# EasyEDA Pro project ProPrj_AI台灯_模块版_2026-09-22.epro, schematic Schematic1, sheet 5 of 5

## Sheets
5 INTERFACE: Page Name: P6
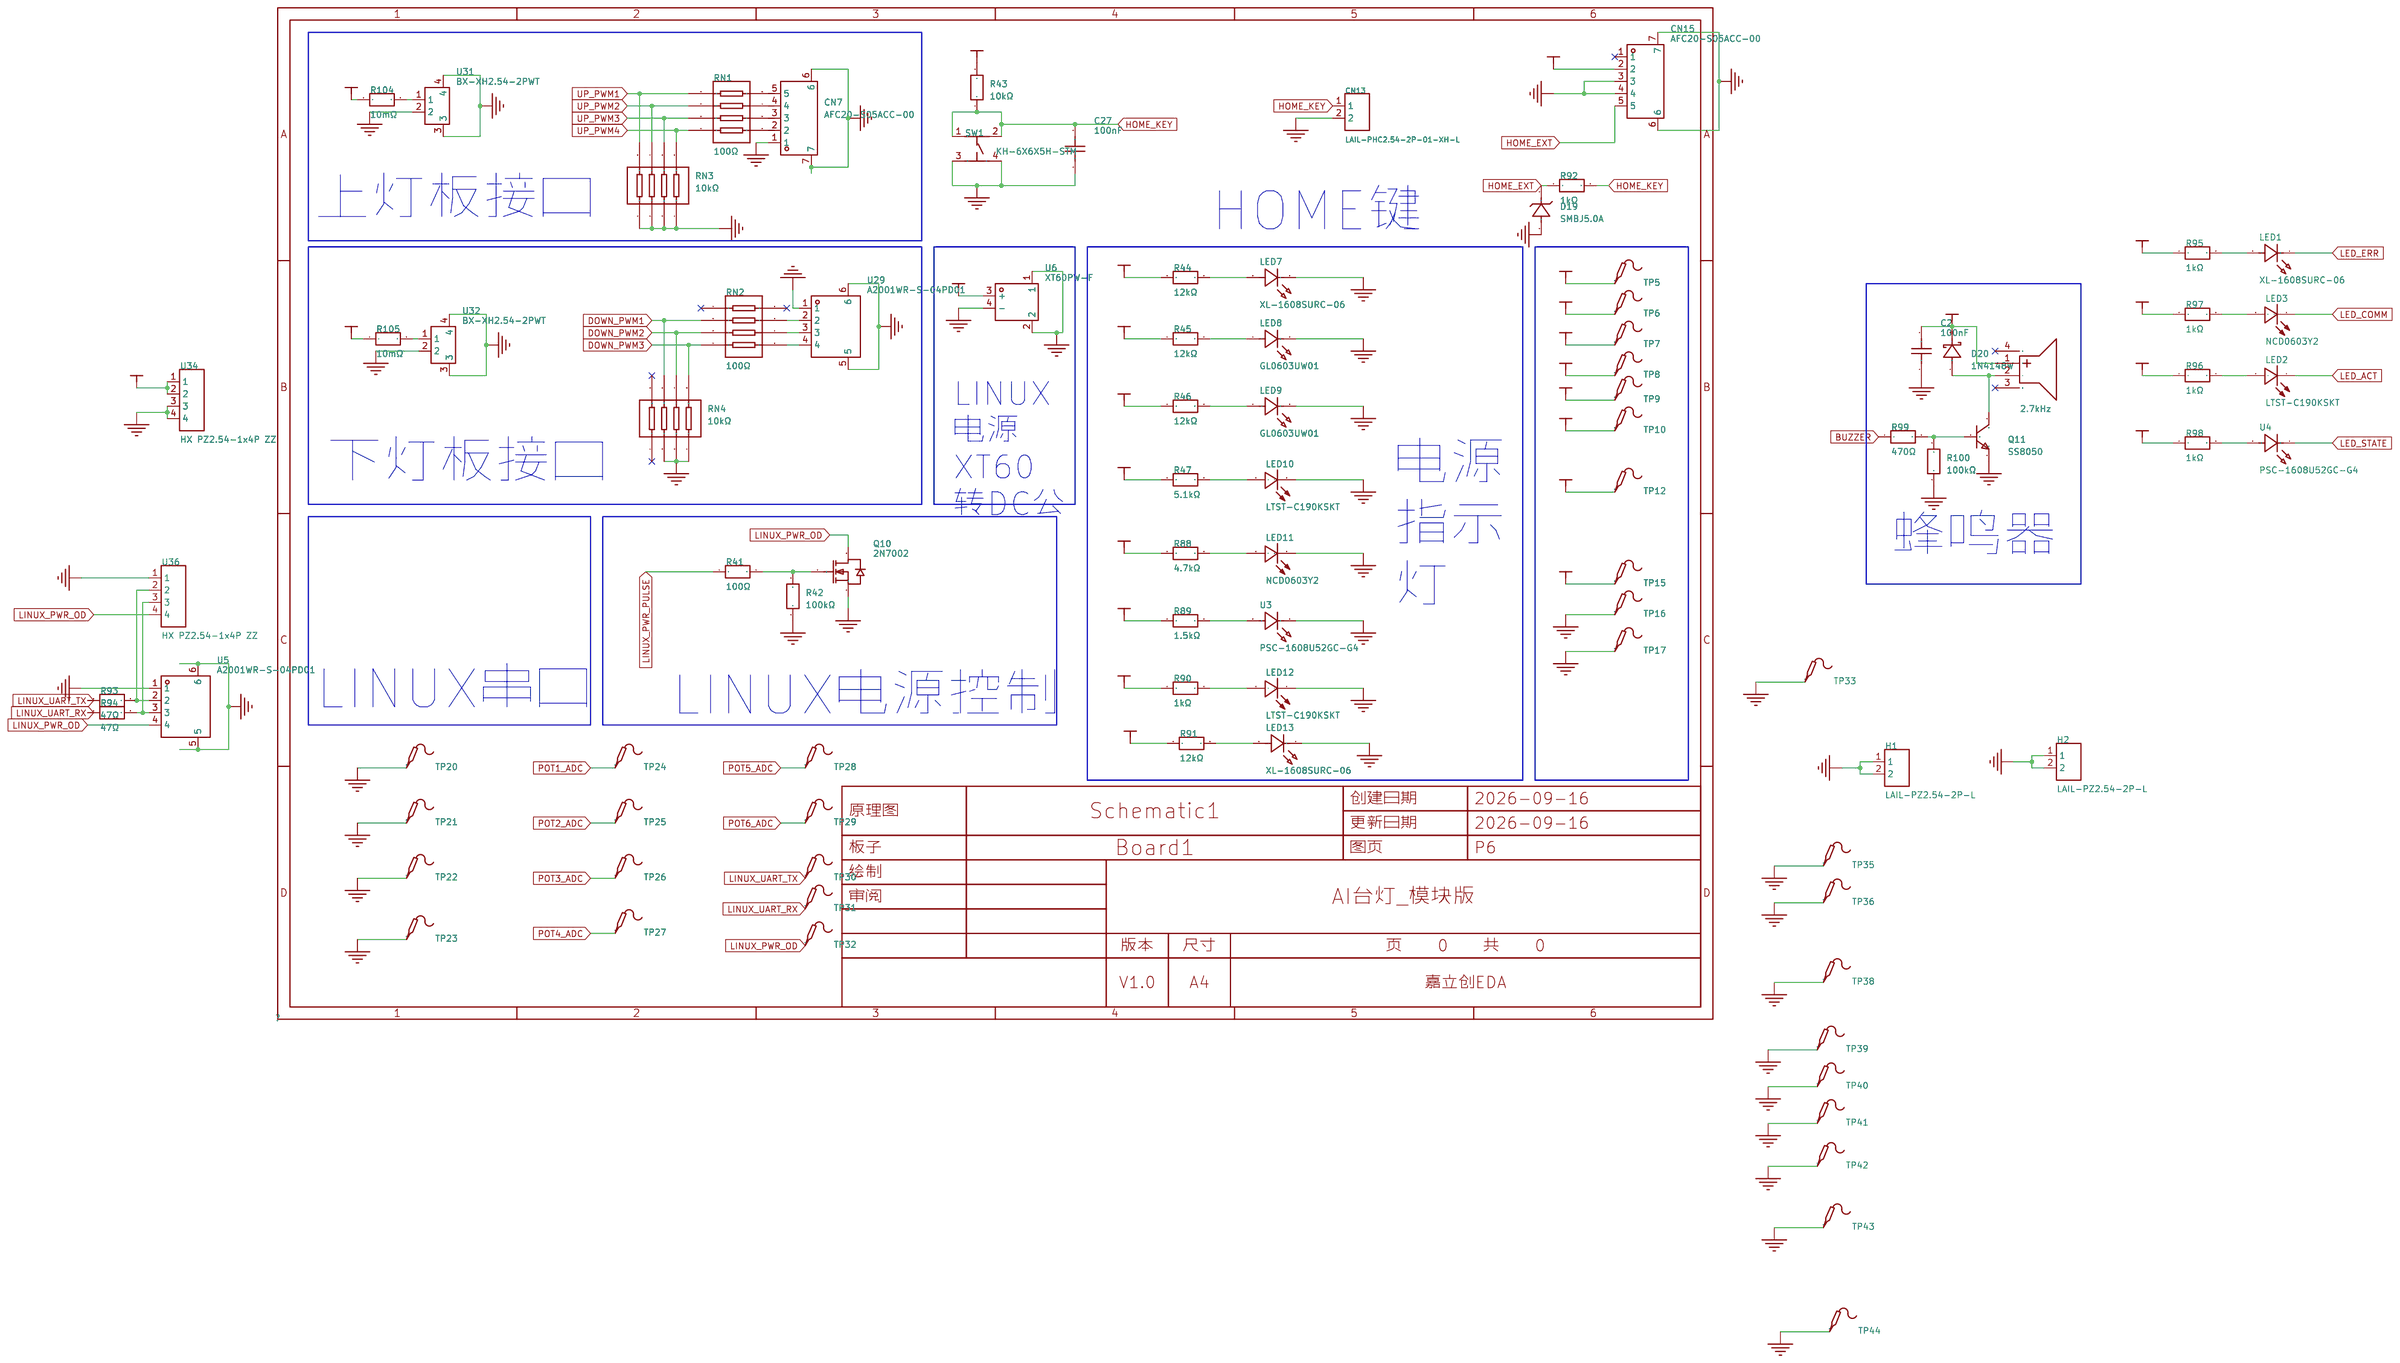
[diagram p4: INTERFACE]

## Parts
BUZZER1  2.7kHz  [BUZ-SMD_4P-L7.5-W7.5-P7.59-TL]
C2  100nF  [C0603]
C27  100nF  [C0603]
CN7  AFC20-S05ACC-00  [CONN-SMD_AFC20-S05ACC-00]
CN13  LAIL-PHC2.54-2P-01-XH-L  [CONN-TH_2P-P2.50_HC-XH-2A-G]
CN15  AFC20-S05ACC-00  [CONN-SMD_AFC20-S05ACC-00]
D19  SMBJ5.0A  [SMB_L4.6-W3.6-LS5.4-RD]
D20  1N4148W  [SOD-123_L2.7-W1.6-LS3.7-FD]
H1  LAIL-PZ2.54-2P-L  [CONN-TH_LAIL-PZ2.54-2P-L]
H2  LAIL-PZ2.54-2P-L  [CONN-TH_LAIL-PZ2.54-2P-L]
LED1  XL-1608SURC-06  [LED0603-RD_RED]
LED2  LTST-C190KSKT  [LED0603-RD]
LED3  NCD0603Y2  [LED0603-RD]
LED7  XL-1608SURC-06  [LED0603-RD_RED]
LED8  GL0603UW01  [LED0603-R-RD]
LED9  GL0603UW01  [LED0603-R-RD]
LED10  LTST-C190KSKT  [LED0603-RD]
LED11  NCD0603Y2  [LED0603-RD]
LED12  LTST-C190KSKT  [LED0603-RD]
LED13  XL-1608SURC-06  [LED0603-RD_RED]
Q10  2N7002  [SOT-23-3_L2.9-W1.3-P1.90-LS2.4-BR]
Q11  SS8050  [SOT-23-3_L2.9-W1.3-P1.90-LS2.4-BR]
R41  100Ω  [R0603]
R42  100kΩ  [R0603]
R43  10kΩ  [R0603]
R44  12kΩ  [R0603]
R45  12kΩ  [R0603]
R46  12kΩ  [R0603]
R47  5.1kΩ  [R0603]
R88  4.7kΩ  [R0603]
R89  1.5kΩ  [R0603]
R90  1kΩ  [R0603]
R91  12kΩ  [R0603]
R92  1kΩ  [R0603]
R93  47Ω  [R0603]
R94  47Ω  [R0603]
R95  1kΩ  [R0603]
R96  1kΩ  [R0603]
R97  1kΩ  [R0603]
R98  1kΩ  [R0603]
R99  470Ω  [R0603]
R100  100kΩ  [R0603]
R104  10mΩ  [R2512]
R105  10mΩ  [R2512]
RN1  100Ω  [RES-ARRAY-SMD_0603-8P-L3.2-W1.6-BL]
RN2  100Ω  [RES-ARRAY-SMD_0603-8P-L3.2-W1.6-BL]
RN3  10kΩ  [RES-ARRAY-SMD_0603-8P-L3.2-W1.6-BL]
RN4  10kΩ  [RES-ARRAY-SMD_0603-8P-L3.2-W1.6-BL]
SW1  KH-6X6X5H-STM  [SW-SMD_4P-L6.0-W6.0-P4.50-LS9.0_H5.0]
TP5  -  [Test-Point-0.5mm]
TP6  -  [Test-Point-0.5mm]
TP7  -  [Test-Point-0.5mm]
TP8  -  [Test-Point-0.5mm]
TP9  -  [Test-Point-0.5mm]
TP10  -  [Test-Point-0.5mm]
TP12  -  [Test-Point-0.5mm]
TP15  -  [Test-Point-0.5mm]
TP16  -  [Test-Point-0.5mm]
TP17  -  [Test-Point-0.5mm]
TP20  -  [Test-Point-0.5mm]
TP21  -  [Test-Point-0.5mm]
TP22  -  [Test-Point-0.5mm]
TP23  -  [Test-Point-0.5mm]
TP24  -  [Test-Point-0.5mm]
TP25  -  [Test-Point-0.5mm]
TP26  -  [Test-Point-0.5mm]
TP27  -  [Test-Point-0.5mm]
TP28  -  [Test-Point-0.5mm]
TP29  -  [Test-Point-0.5mm]
TP30  -  [Test-Point-0.5mm]
TP31  -  [Test-Point-0.5mm]
TP32  -  [Test-Point-0.5mm]
TP33  -  [Test-Point-0.5mm]
TP35  -  [Test-Point-0.5mm]
TP36  -  [Test-Point-0.5mm]
TP38  -  [Test-Point-0.5mm]
TP39  -  [Test-Point-0.5mm]
TP40  -  [Test-Point-0.5mm]
TP41  -  [Test-Point-0.5mm]
TP42  -  [Test-Point-0.5mm]
TP43  -  [Test-Point-0.5mm]
TP44  -  [Test-Point-0.5mm]
U3  PSC-1608U52GC-G4  [LED0603-RD_GREEN]
U4  PSC-1608U52GC-G4  [LED0603-RD_GREEN]
U5  A2001WR-S-04PD01  [CONN-SMD_A2001WR-S-04PD01]
U6  XT60PW-F  [TH_2P-XT60PW-F]
U29  A2001WR-S-04PD01  [CONN-SMD_A2001WR-S-04PD01]
U31  BX-XH2.54-2PWT  [CONN-SMD_2P-P2.50_BX-XH2.54-2PWT]
U32  BX-XH2.54-2PWT  [CONN-SMD_2P-P2.50_BX-XH2.54-2PWT]
U34  HX PZ2.54-1x4P ZZ  [HDR-TH_4P-P2.54-V-M]
U36  HX PZ2.54-1x4P ZZ  [HDR-TH_4P-P2.54-V-M]

## Library data of the parts
BUZZER1 = MLT-7525: 驱动方式:无源(外部驱动);构造类型:电磁式;频率:2.7kHz;声压(SPL):80dB;; Supplier Part: C95299; Manufacturer: 华能; Supplier Footprint: SMD,7.5x7.5mm; JLCPCB Part Class: 扩展库; Datasheet: https://atta.szlcsc.com/upload/public/pdf/source/20220727/FE97E50F9310EA274907AB736C1C5504.pdf; Supplier: LCSC; Driver Circuitry: 无源(外部驱动); Technology: 电磁式; Voltage - Supply: 2.5V~4.5V; Sound Pressure Level(SPL): 80dB; Length: 7.5mm; Width: 7.5mm; Height: 2.8mm
C2 C27 = CC0603KRX7R0BB104: 容值:100nF;精度:±10%;额定电压:100V;温度系数:X7R;; LCSC Part Name: 100nF ±10% 100V; Supplier Part: C113803; Manufacturer: YAGEO(国巨); Supplier Footprint: 0603; JLCPCB Part Class: Extended Part; Datasheet: https://item.szlcsc.com/datasheet/CC0603KRX7R0BB104/115039.html; Supplier: LCSC; Tolerance: ±10%; Voltage Rating: 100V; Temperature Coefficient: X7R
CN7 CN15 = AFC20-S05ACC-00: 插针结构:1x5P;间距:2mm;安装方式:卧贴;参考系列:PH;总PIN数:5P;排数:1;每排PIN数:5;行距:-;额定电流:1A;触头材质:黄铜;触头镀层:锡;工作温度:-20℃~+85℃;; LCSC Part Name: 1x5P 间距:2mm 卧贴 系列:PH; Supplier Part: C395361; Manufacturer: JS(钜硕电子); Supplier Footprint: SMD,P=2mm; JLCPCB Part Class: Extended Part; Datasheet: https://item.szlcsc.com/datasheet/AFC20-S05ACC-00/375897.html; Supplier: LCSC; Pins Structure: 1x5P; Pitch: 2mm; Mounting Type: 卧贴; Reference Series: PH; Number of Pins: 5P; Number of Rows: 1; Number of PINs Per Row: 5; Current Rating: 1A; Contact Material: 黄铜; Contact Plating: 锡; Operating Temperature: -20℃~+85℃; Voltage Rating: 100V; Plastic Material: LCP; Flame Retardant Rating: UL94V-0; Color: 米色; Z-Height of the Board: 5.55mm; X-Length of Bottom Edge on Board (Spacing Line): 14mm
CN13 = LAIL-PHC2.54-2P-01-XH-L: 插针结构:1x2P;间距:2.54mm;安装方式:直插;参考系列:XH;总PIN数:2P;排数:1;每排PIN数:2;额定电流:3A;触头材质:黄铜;触头镀层:锡;工作温度:-25℃~+85℃;; LCSC Part Name: 1x2P 间距:2.54mm 直插 系列:XH; Supplier Part: C54905973; Manufacturer: LAILAN(莱联); Supplier Footprint: 插件,P=2.5mm; JLCPCB Part Class: Extended Part; Datasheet: https://item.szlcsc.com/datasheet/LAIL-PHC2.54-2P-01-XH-L/58431100.html; Supplier: LCSC; Pins Structure: 1x2P; Pitch: 2.54mm; Mounting Type: 直插; Reference Series: XH; Number of Pins: 2P; Number of Rows: 1; Number of PINs Per Row: 2; Current Rating: 3A; Contact Material: 黄铜; Contact Plating: 锡; Operating Temperature: -25℃~+85℃; Voltage Rating: 250V; Plastic Material: PA66; Flame Retardant Rating: UL94V-0; Color: 白色; Z-Height of the Board: 7.1mm; X-Length of Bottom Edge on Board (Spacing Line): 7.5mm; Y-Width of Bottom Edge on Board: 5.8mm
D19 = SMBJ5.0A_C19077558: 极性:单向;反向截止电压(Vrwm):5V;钳位电压:9.2V;峰值脉冲电流(Ipp):65.22A@10/1000us;峰值脉冲功率(Ppp):600W@10/1000us;击穿电压(VBR):7V;; LCSC Part Name: 单向TVS 5V截止 峰值浪涌电流：65.22A@10/1000us; Supplier Part: C19077558; Manufacturer: R+O(宏嘉诚); Supplier Footprint: DO-214AA(SMB); JLCPCB Part Class: Extended Part; Datasheet: https://item.szlcsc.com/datasheet/SMBJ5.0A/20275643.html; Supplier: LCSC; Polarity: 单向; Reverse Stand-Off Voltage (Vrwm): 5V; Clamping Voltage: 9.2V; Peak Pulse Current (Ipp): 65.22A@10/1000us; Peak Pulse Power Dissipation (Ppp): 600W@10/1000us; Voltage - Breakdown: 7V; Reverse Leakage Current (Ir): 800uA; Number of Channels: 单路; Operating Temperature: -55℃~+150℃; level of protection: IEC 61000-4-2; Type: TVS
D20 = 1N4148W_C7420318: 二极管配置:独立式;整流电流:150mA;直流反向耐压(Vr):100V;正向压降(Vf):1.25V@150mA;反向恢复时间(Trr):4ns;; LCSC Part Name: 100V 150mA; Supplier Part: C7420318; Manufacturer: R+O(宏嘉诚); Supplier Footprint: SOD-123; JLCPCB Part Class: Extended Part; Datasheet: https://item.szlcsc.com/datasheet/1N4148W/8397140.html; Supplier: LCSC; Diode Configuration: 独立式; Voltage - Forward(Vf@If): 1.25V@150mA; Voltage - DC Reverse(Vr): 100V; Current - Rectified: 150mA; Reverse Leakage Current (Ir): 1uA@75V; Reverse Recovery Time (trr): 4ns; Operating Junction Temperature Range: -55℃~+150℃; Pd - Power Dissipation: 400mW; Non-Repetitive Peak Forward Surge Current: 2A
H1 H2 = LAIL-PZ2.54-2P-L: 插针结构:1x2P;间距:2.54mm;圆针/方针:方针;排数:单排;总PIN位数:2P;额定电流:3A;额定电压:250V;塑高:2.5mm;端接针长度:3mm;触头材质:黄铜;触头镀层:金;工作温度:-25℃~+80℃;颜色:黑色;; LCSC Part Name: 1x2P 间距:2.54mm 方针; Supplier Part: C54950603; Manufacturer: 莱联; Supplier Footprint: 插件,P=2.54mm; JLCPCB Part Class: Extended Part; Datasheet: https://item.szlcsc.com/datasheet/LAIL-PZ2.54-2P-L/58519956.html; Supplier: LCSC; Pin Structure: 1x2P; Pitch: 2.54mm; Circluar Pins/Square Pins: 方针; Number of Rows: 单排; Number of Pins: 2P; Current Rating: 3A; Voltage Rating (Max): 250V; Insulation Height: 2.5mm; Length of End Connection Pin: 3mm; Contact Material: 黄铜; Contact Plating: 金; Operating Temperature: -25℃~+80℃; Color: 黑色
LED1 LED7 LED13 = XL-1608SURC-06: 灯头类型:1.6mmx0.8mm方形灯头;发光颜色:红色;正向压降(Vf):2.3V;功率:50mW;正向电流:20mA;波长:620nm~630nm;二极管配置:独立二极管;透镜颜色:无色透明透镜;色温:-;发光强度:225mcd;发光角度:120°;载带方式:正贴;工作温度:-40℃~+85℃;; LCSC Part Name: 0603红色贴片式发光二极管; Supplier Part: C965799; Manufacturer: XINGLIGHT(成兴光); Supplier Footprint: 0603; JLCPCB Part Class: Extended Part; Datasheet: https://item.szlcsc.com/datasheet/XL-1608SURC-06/1051408.html; Supplier: LCSC; Lamp Holder Type: 1.6mmx0.8mm方形灯头; Illumination Color: 红色; Voltage - Forward(Vf): 2.3V; Power(Watts): 50mW; Forward Current: 20mA; Wavelength - Dominant: 620nm~630nm; Peak Wavelength: 625nm; Diode Configuration: 独立二极管; Lens Color: 无色透明透镜; Luminous Intensity: 225mcd; Viewing Angle: 120°; Mounting Style: 正贴; Operating Temperature: -40℃~+85℃
LED2 LED10 LED12 = LTST-C190KSKT: 灯头类型:-;发光颜色:黄色;正向压降(Vf):2.1V;功率:75mW;正向电流:20mA;波长:584.5nm~597nm;二极管配置:独立二极管;透镜颜色:无色透明透镜;色温:-;发光强度:104mcd;发光角度:130°;载带方式:-;工作温度:-30℃~+85℃;; LCSC Part Name: 黄灯; Supplier Part: C125095; Manufacturer: LITEON(光宝); Supplier Footprint: 0603; JLCPCB Part Class: Extended Part; Datasheet: https://item.szlcsc.com/datasheet/LTST-C190KSKT/136371.html; Supplier: LCSC; Illumination Color: 黄色; Voltage - Forward(Vf): 2.1V; Power(Watts): 75mW; Forward Current: 20mA; Wavelength - Dominant: 584.5nm~597nm; Peak Wavelength: 588nm; Diode Configuration: 独立二极管; Lens Color: 无色透明透镜; Luminous Intensity: 104mcd; Viewing Angle: 130°; Operating Temperature: -30℃~+85℃
LED3 LED11 = NCD0603Y2: 灯头类型:1.6mmx0.8mm方形灯头;发光颜色:黄色;正向压降(Vf):1.6V~2.6V;功率:65mW;测试电流:25mA;波长:586nm~595nm;二极管配置:独立二极管;透镜颜色:-;色温:-;发光强度:220mcd;发光角度:130°;载带方式:-;工作温度:-30℃~+85℃;; LCSC Part Name: 片式发光二极管; Supplier Part: C89811; Manufacturer: 国星光电; Supplier Footprint: 0603; JLCPCB Part Class: Extended Part; Datasheet: https://item.szlcsc.com/datasheet/NCD0603Y2/90993.html; Supplier: LCSC; Lamp Holder Type: 1.6mmx0.8mm方形灯头; Illumination Color: 黄色; Voltage - Forward(Vf): 1.6V~2.6V; Power(Watts): 65mW; Test Current: 25mA; Wavelength - Dominant: 586nm~595nm; Peak Wavelength: 595nm; Diode Configuration: 独立二极管; Luminous Intensity: 220mcd; Viewing Angle: 130°; Operating Temperature: -30℃~+85℃; Half wave width: 15nm
LED8 LED9 = GL0603UW01: 灯头类型:1.6mmx0.8mm方形灯头;发光颜色:白色;正向压降(Vf):2.5V~3.2V;功率:-;测试电流:5mA;波长:-;二极管配置:独立二极管;透镜颜色:雾状黄色透镜;色温:25000K;发光强度:50mcd~124mcd;发光角度:120°;载带方式:正贴;工作温度:-40℃~+85℃;; LCSC Part Name: 0603 白灯 高亮; Supplier Part: C51933297; Manufacturer: Guiguang light(桂光光电); Supplier Footprint: 0603; JLCPCB Part Class: Extended Part; Datasheet: https://item.szlcsc.com/datasheet/GL0603UW01/54645993.html; Supplier: LCSC; Lamp Holder Type: 1.6mmx0.8mm方形灯头; Illumination Color: 白色; Voltage - Forward(Vf): 2.5V~3.2V; Test Current: 5mA; Diode Configuration: 独立二极管; Lens Color: 雾状黄色透镜; Color Temperature: 25000K; Luminous Intensity: 50mcd~124mcd; Viewing Angle: 120°; Mounting Style: 正贴; Operating Temperature: -40℃~+85℃
Q10 = 2N7002_C7420321: 数量:1个N沟道;漏源电压(Vdss):60V;连续漏极电流(Id):115mA;导通电阻(RDS(on)):900mΩ@10V;耗散功率(Pd):225mW;阈值电压(Vgs(th)):1.6V;; LCSC Part Name: N沟道,电流:115mA,耐压:60V; Supplier Part: C7420321; Manufacturer: R+O(宏嘉诚); Supplier Footprint: SOT-23; JLCPCB Part Class: Extended Part; Datasheet: https://item.szlcsc.com/datasheet/2N7002/8397143.html; Supplier: LCSC; Number: 1个N沟道; Drain to Source Voltage: 60V; Current - Continuous Drain(Id): 115mA; RDS(on): 900mΩ@10V; Pd - Power Dissipation: 225mW; Gate Threshold Voltage (Vgs(th)): 1.6V; Gate Charge(Qg): 1.6nC@10V; Input Capacitance(Ciss): 50pF; Reverse Transfer Capacitance (Crss@Vds): 5pF; Operating Temperature: -55℃~+150℃; Type: N沟道; Output Capacitance(Coss): 25pF
Q11 = SS8050_C7420370: 晶体管类型:NPN;集电极电流(Ic):1.5A;集射极击穿电压(Vceo):25V;耗散功率(Pd):300mW;直流电流增益(hFE):120;; LCSC Part Name: H档 200-350 NPN 电流:1.5A 电压:25V; Supplier Part: C7420370; Manufacturer: R+O(宏嘉诚); Supplier Footprint: SOT-23; JLCPCB Part Class: Extended Part; Datasheet: https://item.szlcsc.com/datasheet/SS8050/8397192.html; Supplier: LCSC; type: NPN; Current - Collector(Ic): 1.5A; Collector - Emitter Voltage VCEO: 25V; Pd - Power Dissipation: 300mW; DC Current Gain: 120; Transition frequency(fT): 100MHz; Current - Collector Cutoff: 100nA; Vce Saturation(VCE(sat)): 500mV; Operating Temperature: -55℃~+150℃; Emitter-Base Voltage(Vebo): 5V; Number: 1个NPN; Configuration: 独立式
R41 = FRC0603F1000TS: 电阻类型:厚膜电阻;阻值:100Ω;精度:±1%;功率:100mW;工作电压:75V;温度系数:±100ppm/℃;; LCSC Part Name: 100Ω ±1% 100mW 厚膜电阻; Supplier Part: C2906981; Manufacturer: FOJAN(富捷); Supplier Footprint: 0603; JLCPCB Part Class: Extended Part; Datasheet: https://item.szlcsc.com/datasheet/FRC0603F1000TS/3180494.html; Supplier: LCSC; Type: 厚膜电阻; Tolerance: ±1%; Power(Watts): 100mW; Voltage-Supply(Max): 75V; Temperature Coefficient: ±100ppm/℃; Operating Temperature: -55℃~+155℃
R42 R100 = FRC0603F1003TS: 电阻类型:厚膜电阻;阻值:100kΩ;精度:±1%;功率:100mW;工作电压:75V;温度系数:±100ppm/℃;; LCSC Part Name: 100kΩ ±1% 100mW 厚膜电阻; Supplier Part: C2906980; Manufacturer: FOJAN(富捷); Supplier Footprint: 0603; JLCPCB Part Class: Extended Part; Datasheet: https://item.szlcsc.com/datasheet/FRC0603F1003TS/3180493.html; Supplier: LCSC; Type: 厚膜电阻; Tolerance: ±1%; Power(Watts): 100mW; Voltage-Supply(Max): 75V; Temperature Coefficient: ±100ppm/℃; Operating Temperature: -55℃~+155℃
R43 = FRC0603J103 TS: 电阻类型:厚膜电阻;阻值:10kΩ;精度:±5%;功率:100mW;工作电压:75V;温度系数:±100ppm/℃;; LCSC Part Name: 10kΩ ±5% 100mW 厚膜电阻; Supplier Part: C2930027; Manufacturer: FOJAN(富捷); Supplier Footprint: 0603; JLCPCB Part Class: Extended Part; Datasheet: https://item.szlcsc.com/datasheet/FRC0603J103%2520TS/3266960.html; Supplier: LCSC; Type: 厚膜电阻; Tolerance: ±5%; Power(Watts): 100mW; Voltage-Supply(Max): 75V; Temperature Coefficient: ±100ppm/℃; Operating Temperature: -55℃~+155℃
R44-R46 R91 = FRC0603F1202TS: 电阻类型:厚膜电阻;阻值:12kΩ;精度:±1%;功率:100mW;工作电压:75V;温度系数:±100ppm/℃;; LCSC Part Name: 12kΩ ±1% 100mW 厚膜电阻; Supplier Part: C2906989; Manufacturer: FOJAN(富捷); Supplier Footprint: 0603; JLCPCB Part Class: Extended Part; Datasheet: https://item.szlcsc.com/datasheet/FRC0603F1202TS/3180502.html; Supplier: LCSC; Type: 厚膜电阻; Tolerance: ±1%; Power(Watts): 100mW; Voltage-Supply(Max): 75V; Temperature Coefficient: ±100ppm/℃; Operating Temperature: -55℃~+155℃
R47 = FRC0603F5101TS: 电阻类型:厚膜电阻;阻值:5.1kΩ;精度:±1%;功率:100mW;工作电压:75V;温度系数:±100ppm/℃;; LCSC Part Name: 5.1kΩ ±1% 100mW 厚膜电阻; Supplier Part: C2907044; Manufacturer: FOJAN(富捷); Supplier Footprint: 0603; JLCPCB Part Class: Extended Part; Supplier: LCSC; Type: 厚膜电阻; Tolerance: ±1%; Power(Watts): 100mW; Voltage-Supply(Max): 75V; Temperature Coefficient: ±100ppm/℃; Operating Temperature: -55℃~+155℃
R88 = FRC0603F4701TS: 电阻类型:厚膜电阻;阻值:4.7kΩ;精度:±1%;功率:100mW;工作电压:75V;温度系数:±100ppm/℃;; LCSC Part Name: 4.7kΩ ±1% 100mW 厚膜电阻; Supplier Part: C2907034; Manufacturer: FOJAN(富捷); Supplier Footprint: 0603; JLCPCB Part Class: Extended Part; Datasheet: https://item.szlcsc.com/datasheet/FRC0603F4701TS/3180547.html; Supplier: LCSC; Type: 厚膜电阻; Tolerance: ±1%; Power(Watts): 100mW; Voltage-Supply(Max): 75V; Temperature Coefficient: ±100ppm/℃; Operating Temperature: -55℃~+155℃
R89 = FRC0603F1501TS: 电阻类型:厚膜电阻;阻值:1.5kΩ;精度:±1%;功率:100mW;工作电压:75V;温度系数:±100ppm/℃;; LCSC Part Name: 1.5kΩ ±1% 100mW 厚膜电阻; Supplier Part: C2930050; Manufacturer: FOJAN(富捷); Supplier Footprint: 0603; JLCPCB Part Class: Extended Part; Supplier: LCSC; Type: 厚膜电阻; Tolerance: ±1%; Power(Watts): 100mW; Voltage-Supply(Max): 75V; Temperature Coefficient: ±100ppm/℃; Operating Temperature: -55℃~+155℃
R90 R92 R95-R98 = FRC0603F1001TS: 电阻类型:厚膜电阻;阻值:1kΩ;精度:±1%;功率:100mW;工作电压:75V;温度系数:±100ppm/℃;; LCSC Part Name: 1kΩ ±1% 100mW 厚膜电阻; Supplier Part: C2907002; Manufacturer: FOJAN(富捷); Supplier Footprint: 0603; JLCPCB Part Class: Extended Part; Datasheet: https://item.szlcsc.com/datasheet/FRC0603F1001TS/3180515.html; Supplier: LCSC; Type: 厚膜电阻; Tolerance: ±1%; Power(Watts): 100mW; Voltage-Supply(Max): 75V; Temperature Coefficient: ±100ppm/℃; Operating Temperature: -55℃~+155℃
R93 R94 = FRC0603F47R0TS: 电阻类型:厚膜电阻;阻值:47Ω;精度:±1%;功率:100mW;工作电压:75V;温度系数:±100ppm/℃;; LCSC Part Name: 47Ω ±1% 100mW 厚膜电阻; Supplier Part: C2907043; Manufacturer: FOJAN(富捷); Supplier Footprint: 0603; JLCPCB Part Class: Extended Part; Datasheet: https://item.szlcsc.com/datasheet/FRC0603F47R0TS/3180556.html; Supplier: LCSC; Type: 厚膜电阻; Tolerance: ±1%; Power(Watts): 100mW; Voltage-Supply(Max): 75V; Temperature Coefficient: ±100ppm/℃; Operating Temperature: -55℃~+155℃
R99 = FRC0603J471 TS: 电阻类型:厚膜电阻;阻值:470Ω;精度:±5%;功率:100mW;工作电压:75V;温度系数:±100ppm/℃;; LCSC Part Name: 470Ω ±5% 100mW 厚膜电阻; Supplier Part: C2907172; Manufacturer: FOJAN(富捷); Supplier Footprint: 0603; JLCPCB Part Class: Extended Part; Supplier: LCSC; Type: 厚膜电阻; Tolerance: ±5%; Power(Watts): 100mW; Voltage-Supply(Max): 75V; Temperature Coefficient: ±100ppm/℃; Operating Temperature: -55℃~+155℃
R104 R105 = JER2512F2R010: 电阻类型:采样电阻;阻值:10mΩ;精度:±1%;功率:2W;温度系数:±50ppm/℃;; LCSC Part Name: 10mΩ 2W 2512 ±1%; Supplier Part: C49164691; Manufacturer: JIERR(捷而瑞); Supplier Footprint: 2512; JLCPCB Part Class: Extended Part; Datasheet: https://item.szlcsc.com/datasheet/JER2512F2R010/51553034.html; Supplier: LCSC; Type: 采样电阻; Tolerance: ±1%; Power(Watts): 2W; Temperature Coefficient: ±50ppm/℃
RN1 RN2 = 4D03WGJ0101T5E: 电阻器数:4;阻值:100Ω;精度:±5%;单个元件功率:62.5mW;温度系数:±200ppm/℃;; LCSC Part Name: 100Ω ±5%; Supplier Part: C25506; Manufacturer: UNI-ROYAL(厚声); Supplier Footprint: 0603x4; JLCPCB Part Class: Extended Part; Datasheet: https://item.szlcsc.com/datasheet/4D03WGJ0101T5E/26249.html; Supplier: LCSC; Number of Resistors: 4; Tolerance: ±5%; Power(Watts): 62.5mW; Temperature Coefficient: ±200ppm/℃; Number of Pins: 8
RN3 RN4 = 4D03WGJ0103T5E: 电阻器数:4;阻值:10kΩ;精度:±5%;单个元件功率:62.5mW;温度系数:±200ppm/℃;; LCSC Part Name: 10kΩ ±5%; Supplier Part: C29718; Manufacturer: UNI-ROYAL(厚声); Supplier Footprint: 0603x4; JLCPCB Part Class: Basic Part; Datasheet: https://atta.szlcsc.com/upload/public/pdf/source/20191224/C474318_2527498AE30E813171187CCD28401A71.pdf; Supplier: LCSC; Number of Resistors: 4; Tolerance: ±5%; Power(Watts): 62.5mW; Temperature Coefficient: ±200ppm/℃; Number of Pins: 8
SW1 = KH-6X6X5H-STM: 电路结构:单刀单掷;按钮形状:圆形按钮;安装方式:立贴;开关长度:6mm;开关宽度:6mm;开关高度:5mm;带支架:不带支架;触点电流:50mA;额定电压:12V;工作寿命:8万次;; LCSC Part Name: 6*6*5mm 立贴 轻触开关; Supplier Part: C2837531; Manufacturer: kinghelm(金航标); Supplier Footprint: SMD-4P,6x6mm; JLCPCB Part Class: Extended Part; Datasheet: https://item.szlcsc.com/datasheet/KH-6X6X5H-STM/3009601.html; Supplier: LCSC; Circuit: 单刀单掷; Actuator Style: 圆形按钮; Mounting Type: 立贴; Length: 6mm; Width: 6mm; Switch Height: 5mm; with Bracket: 不带支架; Contact Current: 50mA; Voltage Rating: 12V; Actuator/Cap Color: 黑色; Termination Style: 鸥翼型; Life: 8万次
TP5-TP10 TP12 TP15-TP17 TP20-TP33 TP35 TP36 TP38-TP44 = Test-Point: Test Point 测试点
U3 U4 = PSC-1608U52GC-G4: 灯头类型:-;发光颜色:绿色;正向压降(Vf):3.1V;功率:66mW;正向电流:10mA;波长:517nm~527nm;二极管配置:独立二极管;透镜颜色:无色透明透镜;色温:-;发光强度:780mcd;发光角度:130°;载带方式:-;工作温度:-40℃~+85℃;; LCSC Part Name: 钻孔1608低亮绿灯; Supplier Part: C22371297; Manufacturer: HONGLITRONIC(鸿利光电); Supplier Footprint: 0603; JLCPCB Part Class: Extended Part; Datasheet: https://item.szlcsc.com/datasheet/PSC-1608U52GC-G4/23857064.html; Supplier: LCSC; Illumination Color: 绿色; Voltage - Forward(Vf): 3.1V; Power(Watts): 66mW; Forward Current: 10mA; Wavelength - Dominant: 517nm~527nm; Diode Configuration: 独立二极管; Lens Color: 无色透明透镜; Luminous Intensity: 780mcd; Viewing Angle: 130°; Operating Temperature: -40℃~+85℃
U5 U29 = A2001WR-S-04PD01: 插针结构:1x4P;间距:2mm;安装方式:卧贴;参考系列:PH;总PIN数:4P;排数:1;每排PIN数:4;行距:-;额定电流:2A;触头材质:黄铜;触头镀层:金;工作温度:-25℃~+85℃;; LCSC Part Name: 1x4P 间距:2mm 卧贴 系列:PH; Supplier Part: C278791; Manufacturer: HR(灿达); Supplier Footprint: SMD,P=2mm; JLCPCB Part Class: Extended Part; Datasheet: https://item.szlcsc.com/datasheet/A2001WR-S-04PD01/265939.html; Supplier: LCSC; Pins Structure: 1x4P; Pitch: 2mm; Mounting Type: 卧贴; Reference Series: PH; Number of Pins: 4P; Number of Rows: 1; Number of PINs Per Row: 4; Current Rating: 2A; Contact Material: 黄铜; Contact Plating: 金; Operating Temperature: -25℃~+85℃; Voltage Rating: 100V; Plastic Material: PA6T; Flame Retardant Rating: UL94V-0; Color: 米色; Z-Height of the Board: 5.5mm; Y-Width of Bottom Edge on Board: 7.65mm
U6 = XT60PW-F: LCSC Part Name: AMASS(艾迈斯)插头锂电池组充电接头 线到板连接器大电流30A连接器 航模电调卧式焊板 母头XT60PW-F.G.Y; Supplier Part: C428722; Manufacturer: AMASS(艾迈斯); JLCPCB Part Class: Extended Part; Datasheet: https://item.szlcsc.com/datasheet/XT60PW-F/423834.html; Supplier: LCSC; colour: 黄色; Connector type: 卧式插头; interface form: 母头
U31 U32 = BX-XH2.54-2PWT: 插针结构:1x2P;间距:2.5mm;安装方式:卧贴;参考系列:XH;总PIN数:2P;排数:1;每排PIN数:2;行距:-;额定电流:3A;触头材质:黄铜;触头镀层:锡;工作温度:-25℃~+85℃;; LCSC Part Name: 1x2P 间距:2.5mm 卧贴 系列:XH; Supplier Part: C18077872; Manufacturer: Bossie(博锡); Supplier Footprint: SMD,P=2.5mm,卧贴; JLCPCB Part Class: Extended Part; Datasheet: https://item.szlcsc.com/datasheet/BX-XH2.54-2PWT/19218273.html; Supplier: LCSC; Pins Structure: 1x2P; Pitch: 2.5mm; Mounting Type: 卧贴; Reference Series: XH; Number of Pins: 2P; Number of Rows: 1; Number of PINs Per Row: 2; Current Rating: 3A; Contact Material: 黄铜; Contact Plating: 锡; Operating Temperature: -25℃~+85℃; Voltage Rating: 250V; Plastic Material: LCP; Supplementary Features: 辅助焊脚; Color: 米色; Z-Height of the Board: 6.2mm; X-Length of Bottom Edge on Board (Spacing Line): 10mm; Y-Width of Bottom Edge on Board: 10.5mm
U34 U36 = HX PZ2.54-1x4P ZZ: 插针结构:1x4P;间距:2.54mm;行距:-;圆针/方针:方针;安装方式:直插;排数:单排;总PIN位数:4P;额定电流:3A;额定电压:1kV;配合针长度:6mm;塑高:2.5mm;端接针长度:3mm;触头材质:黄铜;触头镀层:金;工作温度:-40℃~+105℃;颜色:黑色;; LCSC Part Name: 1x4P 间距:2.54mm 方针 直插; Supplier Part: C32713270; Manufacturer: hanxia(韩下); Supplier Footprint: 插件,P=2.54mm; JLCPCB Part Class: Extended Part; Datasheet: https://item.szlcsc.com/datasheet/HX%2520PZ2.54-1x4P%2520ZZ/34444550.html; Supplier: LCSC; Pin Structure: 1x4P; Pitch: 2.54mm; Circluar Pins/Square Pins: 方针; Mounting Type: 直插; Number of Rows: 单排; Number of Pins: 4P; Current Rating: 3A; Voltage Rating (Max): 1kV; Length of Mating Pin: 6mm; Insulation Height: 2.5mm; Length of End Connection Pin: 3mm; Contact Material: 黄铜; Contact Plating: 金; Operating Temperature: -40℃~+105℃; Color: 黑色

## Nets
3V3_MCU: BUZZER1.1(+) C2.2 CN15.2 D20.2(K) R43.2 R90.1 R95.1 R96.1 R97.1 R98.1 TP15.1 ; also on sheet 1 2
5V_SYS: R89.1 ; also on sheet 1
12V_LINUX: R88.1 U6.3(+) U34.1 U34.2 ; also on sheet 1
12V_MOTOR: R47.1 ; also on sheet 1 3
24V_DOWN_LAMP: R46.1 R105.1 TP9.1 ; also on sheet 1
24V_LINUX_IN: TP12.1 ; also on sheet 1
24V_MOTOR_IN: TP10.1 ; also on sheet 1
24V_UP_LAMP: R45.1 R104.1 TP8.1 ; also on sheet 1
GND: C2.1 C27.1 CN7.1 CN7.6 CN7.7 CN13.2 CN15.3 CN15.4 CN15.6 CN15.7 D19.2(A) H1.1 H1.2 H2.1 H2.2 LED7.1(K) LED8.2(C) LED9.2(C) LED10.1(-) LED11.1(K) LED12.1(-) LED13.1(K) Q10.2(S) Q11.2(E) R42.1 R100.1 RN3.1 RN3.2 RN3.3 RN3.4 RN4.1 RN4.2 RN4.3 SW1.3 SW1.4 TP16.1 TP17.1 TP20.1 TP21.1 TP22.1 TP23.1 TP33.1 TP35.1 TP36.1 TP38.1 TP39.1 TP40.1 TP41.1 TP42.1 TP43.1 TP44.1 U3.1(K) U5.1 U5.5 U5.6 U6.1 U6.2 U6.4(-) U29.1 U29.5 U29.6 U31.2 U31.3 U31.4 U32.2 U32.3 U32.4 U34.3 U34.4 U36.1 ; also on sheet 1 2 3 4
VIN_24_FUSED: R91.1 TP6.1 ; also on sheet 1
VIN_24_RAW: TP5.1 ; also on sheet 1
VIN_24_SW: R44.1 TP7.1 ; also on sheet 1
BUZZER: R99.1 ; also on sheet 2
DOWN_PWM1: RN2.3 RN4.6 ; also on sheet 2
DOWN_PWM2: RN2.2 RN4.7 ; also on sheet 2
DOWN_PWM3: RN2.1 RN4.8 ; also on sheet 2
HOME_EXT: CN15.5 D19.1(K) R92.1
HOME_KEY: C27.2 CN13.1 R43.1 R92.2 SW1.1 SW1.2 ; also on sheet 2
LED_ACT: LED2.1(-) ; also on sheet 2
LED_COMM: LED3.1(K) ; also on sheet 2
LED_ERR: LED1.1(K) ; also on sheet 2
LED_STATE: U4.1(K) ; also on sheet 2
LINUX_PWR_OD: Q10.3(D) TP32.1 U5.4 U36.4
LINUX_PWR_PULSE: R41.1 ; also on sheet 2
LINUX_UART_RX: R94.1 TP31.1 ; also on sheet 2
LINUX_UART_TX: R93.1 TP30.1 ; also on sheet 2
PC0: TP26.1 ; also on sheet 2 4
PC1: TP25.1 ; also on sheet 2 4
PC2: TP24.1 ; also on sheet 2 4
PC3: TP27.1 ; also on sheet 2 4
PC4: TP28.1 ; also on sheet 2 4
PC5: TP29.1 ; also on sheet 2 4
PE9: RN1.1 RN3.8 ; also on sheet 2
PE11: RN1.2 RN3.7 ; also on sheet 2
PE13: RN1.4 RN3.5 ; also on sheet 2
PE14: RN1.3 RN3.6 ; also on sheet 2
$6N23: Q10.1(G) R41.2 R42.2
$6N43: LED12.2(+) R90.2
$6N45: R89.2 U3.2(A)
$6N47: LED11.2(A) R88.2
$6N49: LED10.2(+) R47.2
$6N51: LED9.1(A) R46.2
$6N53: LED8.1(A) R45.2
$6N55: LED7.2(A) R44.2
$6N69: LED13.2(A) R91.2
$6N99: CN7.5 RN1.8
$6N100: CN7.4 RN1.7
$6N101: CN7.3 RN1.6
$6N102: CN7.2 RN1.5
$6N108: RN2.8 U29.4
$6N110: RN2.7 U29.3
$6N112: RN2.6 U29.2
$6N129: BUZZER1.2(-) D20.1(A) Q11.3(C)
$6N131: LED1.2(A) R95.2
$6N140: R98.2 U4.2(A)
$6N147: Q11.1(B) R99.2 R100.2
$6N164: R93.2 U5.2 U36.2
$6N165: R94.2 U5.3 U36.3
$6N188: LED2.2(+) R96.2
$6N189: LED3.2(A) R97.2
$6N191: R104.2 U31.1
$6N193: R105.2 U32.1

Not connected (* = marked no-connect by the designer): BUZZER1 3* 4*; CN15 1*; RN2 4* 5*; RN4 4* 5*

## Notes on the sheets
sheet 5
- 上灯板接口
- HOME键
- LINUX
  电源
  XT60
  转DC公
- 电源
  指示
  灯
- 下灯板接口
- 蜂鸣器
- LINUX串口
- LINUX电源控制
